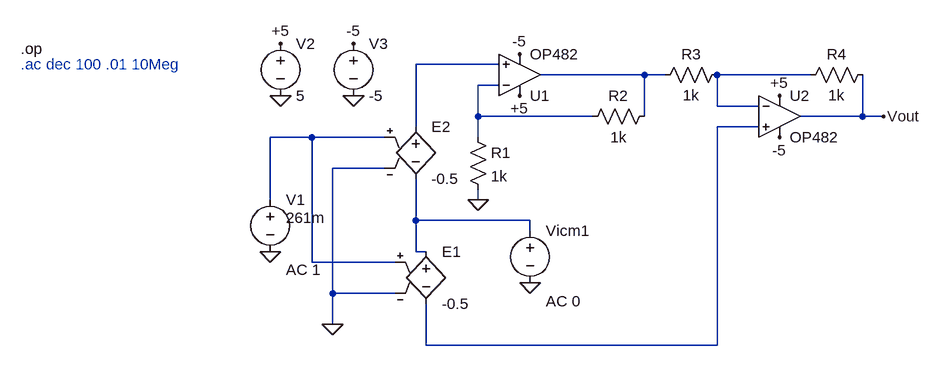
[diagram p0: schematic Etaju1OPsiAC.asc]
Etaju1OPsiAC.asc, the LTspice schematic file:
Version 4.1
SHEET 1 1856 1476
WIRE -176 64 -304 64
WIRE 48 80 -112 80
WIRE 80 80 48 80
WIRE 304 80 160 80
WIRE -176 96 -208 96
WIRE 160 128 160 80
WIRE 224 128 160 128
WIRE -208 144 -208 96
WIRE -32 144 -208 144
WIRE 48 144 48 80
WIRE 384 144 384 80
WIRE 384 144 288 144
WIRE 416 144 384 144
WIRE -304 160 -304 64
WIRE 224 160 160 160
WIRE -464 176 -528 176
WIRE -352 176 -464 176
WIRE -208 176 -208 144
WIRE -352 224 -432 224
WIRE -528 272 -528 176
WIRE -208 272 -208 256
WIRE -304 304 -304 240
WIRE -128 304 -304 304
WIRE -128 320 -128 304
WIRE -304 352 -304 304
WIRE -288 352 -304 352
WIRE -464 368 -464 176
WIRE -336 368 -464 368
WIRE -432 416 -432 224
WIRE -336 416 -432 416
WIRE -432 464 -432 416
WIRE -288 496 -288 432
WIRE 160 496 160 160
WIRE 160 496 -288 496
FLAG -208 272 0
FLAG -144 112 +5
FLAG -144 48 -5
FLAG 256 176 -5
FLAG 256 112 +5
FLAG -432 464 0
FLAG -528 352 0
FLAG -128 400 0
FLAG -512 32 +5
FLAG -400 32 -5
FLAG -512 112 0
FLAG -400 112 0
FLAG 416 144 Vout
DATAFLAG 192 80 ""
DATAFLAG -304 112 ""
DATAFLAG -256 496 ""
DATAFLAG 384 112 ""
DATAFLAG -48 80 ""
DATAFLAG -240 64 ""
DATAFLAG -192 304 ""
DATAFLAG -208 160 ""
DATAFLAG -128 144 ""
DATAFLAG -432 176 ""
DATAFLAG -416 224 ""
DATAFLAG -416 368 ""
DATAFLAG 192 160 ""
SYMBOL OpAmps\\OP482 -144 144 M180
SYMATTR InstName U1
SYMBOL OpAmps\\OP482 256 80 R0
SYMATTR InstName U2
SYMBOL res -224 160 R0
SYMATTR InstName R1
SYMATTR Value 1k
SYMBOL res 64 128 R90
WINDOW 0 0 56 VBottom 2
WINDOW 3 32 56 VTop 2
SYMATTR InstName R2
SYMATTR Value 1k
SYMBOL res 176 64 R90
WINDOW 0 0 56 VBottom 2
WINDOW 3 32 56 VTop 2
SYMATTR InstName R3
SYMATTR Value 1k
SYMBOL res 400 64 R90
WINDOW 0 0 56 VBottom 2
WINDOW 3 32 56 VTop 2
SYMATTR InstName R4
SYMATTR Value 1k
SYMBOL e -288 336 R0
SYMATTR InstName E1
SYMATTR Value -0.5
SYMBOL e -304 144 R0
SYMATTR InstName E2
SYMATTR Value -0.5
SYMBOL voltage -528 256 R0
WINDOW 123 24 124 Left 2
WINDOW 39 0 0 Left 0
WINDOW 3 24 44 Left 2
SYMATTR Value2 AC 1
SYMATTR Value 261m
SYMATTR InstName V1
SYMBOL voltage -128 304 R0
WINDOW 123 24 124 Left 2
WINDOW 39 0 0 Left 0
SYMATTR Value2 AC 0
SYMATTR InstName Vicm1
SYMATTR Value ""
SYMBOL voltage -512 16 R0
SYMATTR InstName V2
SYMATTR Value 5
SYMBOL voltage -400 16 R0
SYMATTR InstName V3
SYMATTR Value -5
TEXT -912 40 Left 2 !.op
TEXT -912 64 Left 2 ;.ac dec 100 .01 10Meg

The netlist it stands for:
* Etaju1OPsiAC.asc
X§U1 N001 N004 +5 -5 N002 OP482  ; pins In+ In- V+ V- OUT
X§U2 N005 N003 +5 -5 Vout OP482  ; pins In+ In- V+ V- OUT
R1 N004 0 1k
R2 N002 N004 1k
R3 N003 N002 1k
R4 Vout N003 1k
E1 N007 N005 N006 0 -0.5
E2 N001 N007 N006 0 -0.5
V1 N006 0 261m AC 1
Vicm1 N007 0 AC 0
V2 +5 0 5
V3 -5 0 -5
.op
* .ac dec 100 .01 10Meg
.backanno
.end